# EAGLE board zx_kit2 (EAGLE 6.5.0), part 1 of 2
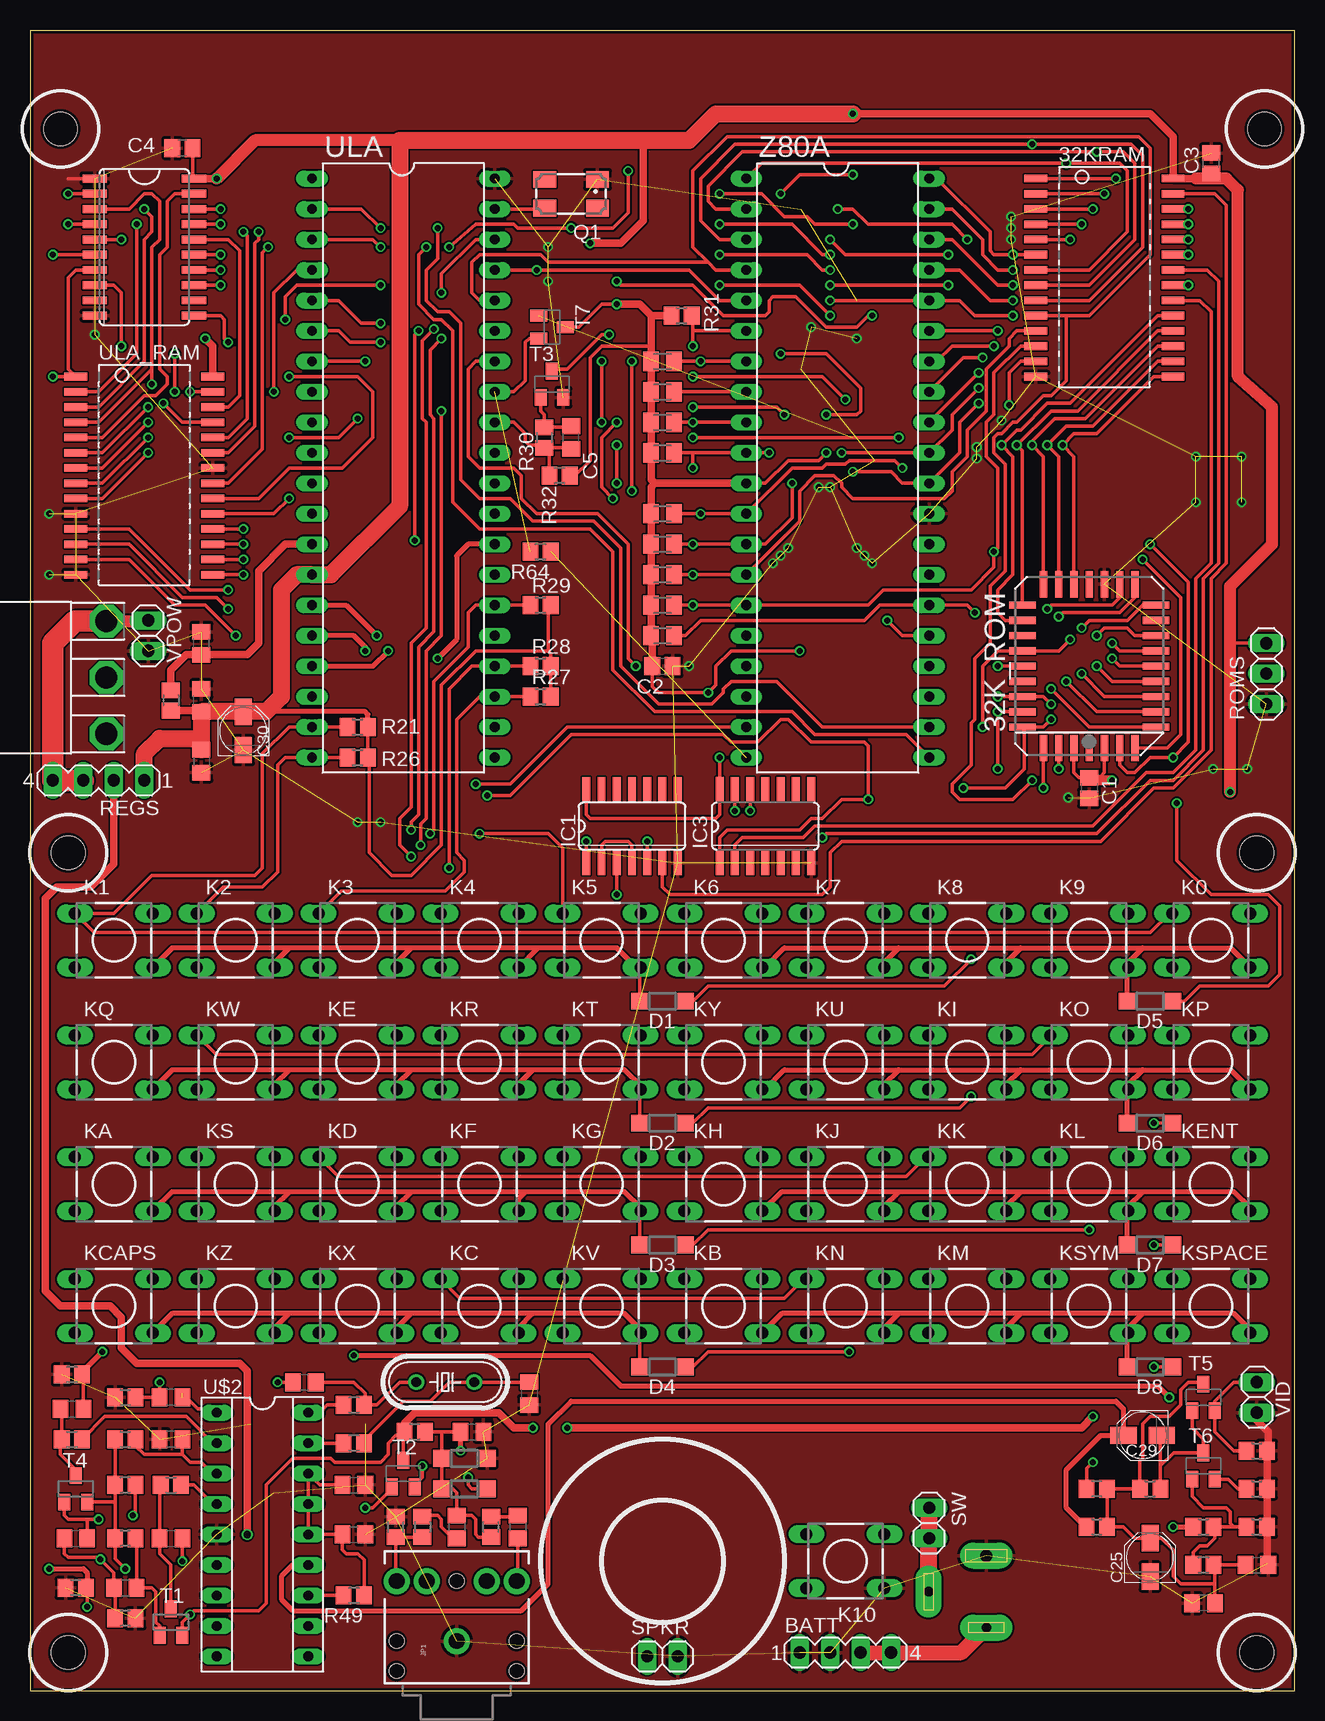
[diagram p3: board, top side]
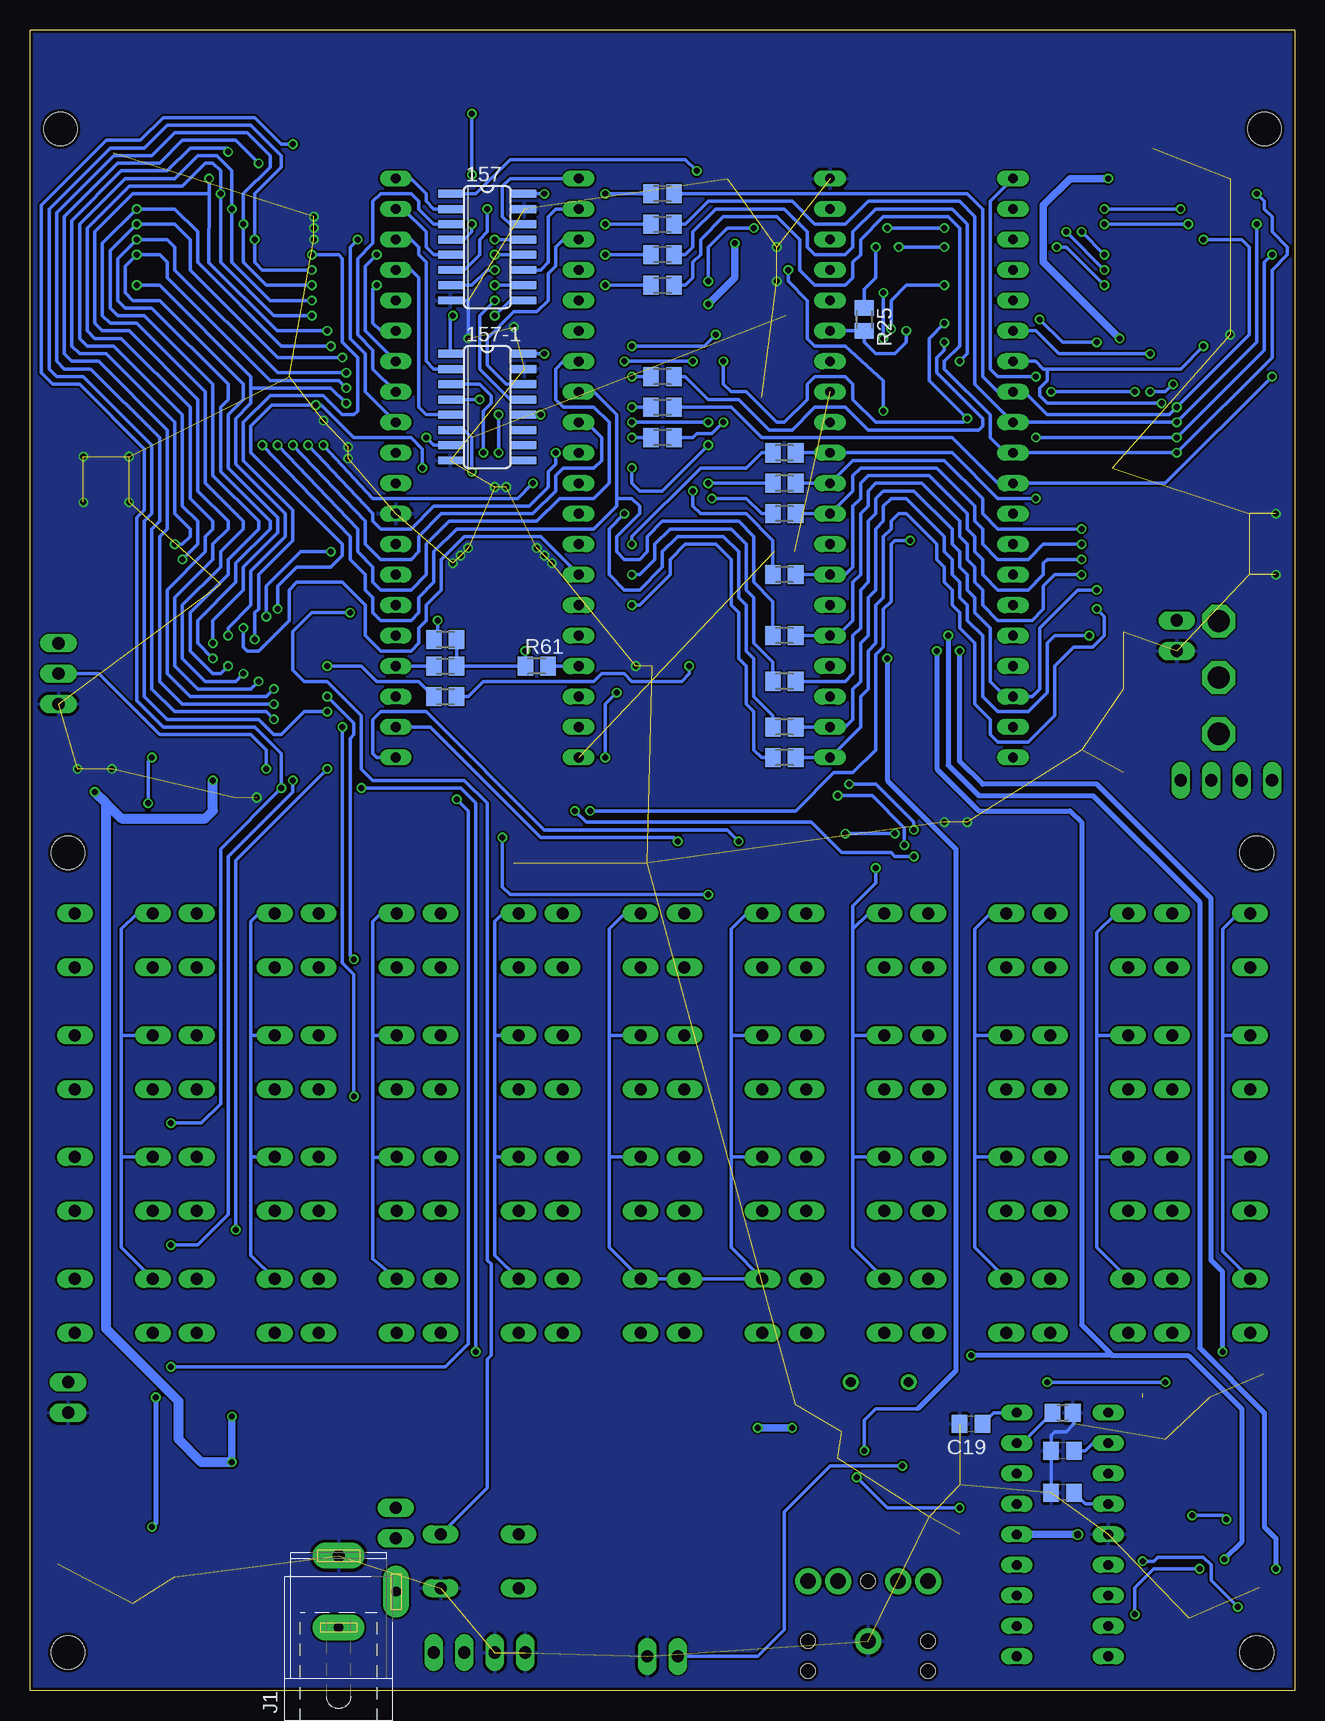
[diagram p4: board, bottom side, seen from below]

Size 105.41 x 138.43 mm. Coordinates in mm from the lower left corner, seen from the top.
Outline: 0,0 105.41,0 105.41,138.43 0,138.43 0,0
Copper layers (1*16): Top 0.035mm / dielectric 1.5mm / Bottom 0.035mm
Design rules "SeeedStudio_2layer_DRU_no_angle_20140221": minimum track width 6mil, minimum drill 12mil, track to track 6mil, track to pad 6mil, pad to pad 6mil, via to via 6mil, smd to smd 0mil, copper to edge 10mil, drill to drill 10mil, minimum pad ring 10mil, minimum via ring 6mil, stop-mask expansion 2mil, vias tented up to drill 100mil, thermal gap 10mil
Holes 2.8 mm at 102.23,3.17 3.17,3.17 102.87,130.18 2.54,130.18 102.23,69.85 3.17,69.85

## Footprints (pad centres in the part's own frame; a part is rotated, then mirrored left to right if it is on the bottom)
PLCC-32 = smd 2.2 x 0.6: 1 -6.83,0; 2 -6.83,-1.27; 3 -6.83,-2.54; 4 -6.83,-3.81; 14 6.83,-3.81; 15 6.83,-2.54; 16 6.83,-1.27; 17 6.83,0; 18 6.83,1.27; 19 6.83,2.54; 20 6.83,3.81; 30 -6.83,3.81; 31 -6.83,2.54; 32 -6.83,1.27 | smd 0.6 x 2.2: 5 -5.08,-5.56; 6 -3.81,-5.56; 7 -2.54,-5.56; 8 -1.27,-5.56; 9 0,-5.56; 10 1.27,-5.56; 11 2.54,-5.56; 12 3.81,-5.56; 13 5.08,-5.56; 21 5.08,5.56; 22 3.81,5.56; 23 2.54,5.56; 24 1.27,5.56; 25 0,5.56; 26 -1.27,5.56; 27 -2.54,5.56; 28 -3.81,5.56; 29 -5.08,5.56
SOJ28/3 = smd 0.635 x 1.905: 1 -8.255,-5.715; 2 -6.985,-5.715; 3 -5.715,-5.715; 4 -4.445,-5.715; 5 -3.175,-5.715; 6 -1.905,-5.715; 7 -0.635,-5.715; 8 0.635,-5.715; 9 1.905,-5.715; 10 3.175,-5.715; 11 4.445,-5.715; 12 5.715,-5.715; 13 6.985,-5.715; 14 8.255,-5.715; 15 8.255,5.715; 16 6.985,5.715; 17 5.715,5.715; 18 4.445,5.715; 19 3.175,5.715; 20 1.905,5.715; 21 0.635,5.715; 22 -0.635,5.715; 23 -1.905,5.715; 24 -3.175,5.715; 25 -4.445,5.715; 26 -5.715,5.715; 27 -6.985,5.715; 28 -8.255,5.715
SO16 = smd 0.66 x 2.032: 1 -4.445,-3.073; 2 -3.175,-3.073; 3 -1.905,-3.073; 4 -0.635,-3.073; 5 0.635,-3.073; 6 1.905,-3.073; 7 3.175,-3.073; 8 4.445,-3.073; 9 4.445,3.073; 10 3.175,3.073; 11 1.905,3.073; 12 0.635,3.073; 13 -0.635,3.073; 14 -1.905,3.073; 15 -3.175,3.073; 16 -4.445,3.073
MA04-1 = drill 1.016 long: 1 -3.81,0; 2 -1.27,0; 3 1.27,0; 4 3.81,0
C0805 = smd 1.3 x 1.5: 1 -0.85,0; 2 0.85,0
C0805' = smd 1.3 x 1.5: 1 -0.95,0; 2 0.95,0
PANASONIC_B = smd 2.2 x 1.4: + 1.6,0; - -1.6,0
SOD123 = smd 1.4 x 1.4: A 1.9,0; C -1.9,0
SO14 = smd 0.66 x 2.032: 1 -3.81,-3.073; 2 -2.54,-3.073; 3 -1.27,-3.073; 4 0,-3.073; 5 1.27,-3.073; 6 2.54,-3.073; 7 3.81,-3.073; 8 3.81,3.073; 9 2.54,3.073; 10 1.27,3.073; 11 0,3.073; 12 -1.27,3.073; 13 -2.54,3.073; 14 -3.81,3.073
SPC4077 = drill 0.8 pad 2.184 long: 1 -3,0; 2 0,-4.8 | drill 1 pad 2.184 long: 3 3,0
AUDIO-JACK = drill 1.3 pad 2.184: RING 5,5; RSH 5,2.5; SLEEVE 0,0; TIP 5,-5; TSH 5,-2.5 | hole 1.2: 0,5; -2.5,5; -2.5,-5; 0,-5; 5,0
DTS-6 = drill 1 long: 1 -3.25,2.25; 2 3.25,2.25; 3 -3.25,-2.25; 4 3.25,-2.25
CTS406 = smd 1.9 x 1.4: 1 -2.2,-1.2; 2 2.2,-1.2; 3 2.2,1.2; 4 -2.2,1.2
HC49/S = drill 0.813: 1 -2.413,0; 2 2.413,0
M0805 = smd 1.3 x 1.6: 1 -0.95,0; 2 0.95,0
R0805 = smd 1.3 x 1.5: 1 -0.85,0; 2 0.85,0
1X03 = drill 1.016 long: 1 -2.54,0; 2 0,0; 3 2.54,0
1X02 = drill 1.016 long: 1 -1.27,0; 2 1.27,0
SOT23 = smd 1 x 1.4: 1 -0.95,-1.1; 2 0.95,-1.1; 3 0,1.1
SOT23-BEC = smd 1 x 1.4: B -0.95,-1.1; C 0,1.1; E 0.95,-1.1
SO20W = smd 0.66 x 2.032: 1 -5.715,-4.128; 2 -4.445,-4.128; 3 -3.175,-4.128; 4 -1.905,-4.128; 5 -0.635,-4.128; 6 0.635,-4.128; 7 1.905,-4.128; 8 3.175,-4.128; 9 4.445,-4.128; 10 5.715,-4.128; 11 5.715,4.128; 12 4.445,4.128; 13 3.175,4.128; 14 1.905,4.128; 15 0.635,4.128; 16 -0.635,4.128; 17 -1.905,4.128; 18 -3.175,4.128; 19 -4.445,4.128; 20 -5.715,4.128
SOCKET-18 = drill 0.813 long: 1 -10.16,-3.81; 2 -7.62,-3.81; 3 -5.08,-3.81; 4 -2.54,-3.81; 5 0,-3.81; 6 2.54,-3.81; 7 5.08,-3.81; 8 7.62,-3.81; 9 10.16,-3.81; 10 10.16,3.81; 11 7.62,3.81; 12 5.08,3.81; 13 2.54,3.81; 14 0,3.81; 15 -2.54,3.81; 16 -5.08,3.81; 17 -7.62,3.81; 18 -10.16,3.81
MS12ASG30_01 = drill 1.854 octagon: 1 4.699,0; 2 0,0; 3 -4.699,0
DIL40 = drill 0.813 long: 1 -24.13,-7.62; 2 -21.59,-7.62; 3 -19.05,-7.62; 4 -16.51,-7.62; 5 -13.97,-7.62; 6 -11.43,-7.62; 7 -8.89,-7.62; 8 -6.35,-7.62; 9 -3.81,-7.62; 10 -1.27,-7.62; 11 1.27,-7.62; 12 3.81,-7.62; 13 6.35,-7.62; 14 8.89,-7.62; 15 11.43,-7.62; 16 13.97,-7.62; 17 16.51,-7.62; 18 19.05,-7.62; 19 21.59,-7.62; 20 24.13,-7.62; 21 24.13,7.62; 22 21.59,7.62; 23 19.05,7.62; 24 16.51,7.62; 25 13.97,7.62; 26 11.43,7.62; 27 8.89,7.62; 28 6.35,7.62; 29 3.81,7.62; 30 1.27,7.62; 31 -1.27,7.62; 32 -3.81,7.62; 33 -6.35,7.62; 34 -8.89,7.62; 35 -11.43,7.62; 36 -13.97,7.62; 37 -16.51,7.62; 38 -19.05,7.62; 39 -21.59,7.62; 40 -24.13,7.62

## Placement (x,y rotation side)
32K_ROM  27C256L  [PLCC-32]  88.27,85.41 90 top
32KRAM  CY62256LL-SNXI  [SOJ28/3]  89.53,117.79 270 top
157  SN74HC157D  [SO16]  67.31,120.33 270 bottom
157-1  SN74HC157D  [SO16]  67.31,107 270 bottom
BATT  [MA04-1]  67.94,3.17 0 top
C1  .1  [C0805]  88.27,75.25 270 top
C2  .1  [C0805]  52.7,85.41 0 top
C3  .1  [C0805]  98.42,127.32 90 top
C4  .1  [C0805]  12.7,128.59 180 top
C5  100pf  [C0805']  45.09,104.46 90 top
C6  .1uf  [C0805']  14.29,82.55 90 top
C7  22nf  [C0805']  14.29,87.31 90 top
C8  22nf  [C0805']  14.29,77.47 270 top
C9  .1uf  [C0805']  40.64,13.65 270 top
C10  .1uf  [C0805']  35.56,13.65 270 top
C11  10nf  [C0805']  36.83,21.59 0 top
C12  .1uf  [C0805']  3.81,12.7 0 top
C13  .1uf  [C0805']  7.94,8.57 0 top
C14  22nf  [C0805']  11.75,20.95 180 top
C15  .1uf  [C0805']  3.49,23.5 0 top
C16  .1uf  [C0805']  11.75,12.7 0 top
C17  10nf  [C0805']  11.75,24.45 180 top
C18  33pf  [C0805']  22.86,25.72 0 top
C19  33pf  [C0805']  26.99,22.23 180 bottom
C20  16pf  [C0805']  41.59,24.77 270 top
C21  150pf  [C0805']  19.37,20 180 bottom
C22  150pf  [C0805']  19.37,16.51 180 bottom
C23  22nf  [C0805']  26.99,17.14 0 top
C24  47nf  [C0805']  26.99,13.02 0 top
C25  22uf  [PANASONIC_B]  93.34,11.11 90 top
C26  22nf  [C0805']  97.79,7.3 180 top
C27  22nf  [C0805']  102.23,10.48 0 top
C29  22uf  [PANASONIC_B]  92.71,21.27 180 top
C30  22uf  [PANASONIC_B]  17.78,80.01 90 top
D1  [SOD123]  52.7,57.47 180 top
D2  [SOD123]  52.7,47.31 180 top
D3  [SOD123]  52.7,37.15 180 top
D4  [SOD123]  52.7,26.99 180 top
D5  [SOD123]  93.34,57.47 180 top
D6  [SOD123]  93.34,47.31 180 top
D7  [SOD123]  93.34,37.15 180 top
D8  [SOD123]  93.34,26.99 180 top
D9  [SOD123]  36.2,19.37 0 top
D10  [SOD123]  36.2,16.83 180 top
IC1  74LS32D  [SO14]  50.16,72.07 0 top
IC3  74AC04D  [SO14]  61.28,72.07 0 top
J1  [SPC4077]  79.69,8.26 90 bottom
JP1  [AUDIO-JACK]  35.56,4.13 90 top
K0  DTS-6  [DTS-6]  98.42,62.55 0 top
K1  DTS-6  [DTS-6]  6.99,62.55 0 top
K2  DTS-6  [DTS-6]  17.14,62.55 0 top
K3  DTS-6  [DTS-6]  27.3,62.55 0 top
K4  DTS-6  [DTS-6]  37.47,62.55 0 top
K5  DTS-6  [DTS-6]  47.62,62.55 0 top
K6  DTS-6  [DTS-6]  57.78,62.55 0 top
K7  DTS-6  [DTS-6]  67.94,62.55 0 top
K8  DTS-6  [DTS-6]  78.11,62.55 0 top
K9  DTS-6  [DTS-6]  88.27,62.55 0 top
K10  DTS-6  [DTS-6]  67.94,10.79 180 top
KA  DTS-6  [DTS-6]  6.99,42.23 0 top
KB  DTS-6  [DTS-6]  57.78,32.07 0 top
KC  DTS-6  [DTS-6]  37.47,32.07 0 top
KCAPS  DTS-6  [DTS-6]  6.99,32.07 0 top
KD  DTS-6  [DTS-6]  27.3,42.23 0 top
KE  DTS-6  [DTS-6]  27.3,52.39 0 top
KENT  DTS-6  [DTS-6]  98.42,42.23 0 top
KF  DTS-6  [DTS-6]  37.47,42.23 0 top
KG  DTS-6  [DTS-6]  47.62,42.23 0 top
KH  DTS-6  [DTS-6]  57.78,42.23 0 top
KI  DTS-6  [DTS-6]  78.11,52.39 0 top
KJ  DTS-6  [DTS-6]  67.94,42.23 0 top
KK  DTS-6  [DTS-6]  78.11,42.23 0 top
KL  DTS-6  [DTS-6]  88.27,42.23 0 top
KM  DTS-6  [DTS-6]  78.11,32.07 0 top
KN  DTS-6  [DTS-6]  67.94,32.07 0 top
KO  DTS-6  [DTS-6]  88.27,52.39 0 top
KP  DTS-6  [DTS-6]  98.42,52.39 0 top
KQ  DTS-6  [DTS-6]  6.99,52.39 0 top
KR  DTS-6  [DTS-6]  37.47,52.39 0 top
KS  DTS-6  [DTS-6]  17.14,42.23 0 top
KSPACE  DTS-6  [DTS-6]  98.42,32.07 0 top
KSYM  DTS-6  [DTS-6]  88.27,32.07 0 top
KT  DTS-6  [DTS-6]  47.62,52.39 0 top
KU  DTS-6  [DTS-6]  67.94,52.39 0 top
KV  DTS-6  [DTS-6]  47.62,32.07 0 top
KW  DTS-6  [DTS-6]  17.14,52.39 0 top
KX  DTS-6  [DTS-6]  27.3,32.07 0 top
KY  DTS-6  [DTS-6]  57.78,52.39 0 top
KZ  DTS-6  [DTS-6]  17.14,32.07 0 top
Q1  14MHz  [CTS406]  45.09,124.78 180 top
Q2  4.43MHz  [HC49/S]  34.61,25.72 180 top
R1  470  [M0805]  42.55,87.95 0 bottom
R2  470  [M0805]  42.55,93.03 0 bottom
R3  470  [M0805]  42.55,98.11 0 bottom
R4  470  [M0805]  42.55,84.14 0 bottom
R5  470  [M0805]  42.55,77.79 0 bottom
R6  470  [M0805]  42.55,80.33 0 bottom
R7  470  [M0805]  42.55,100.65 0 bottom
R8  470  [M0805]  42.55,103.19 0 bottom
R9  8K2  [M0805]  52.7,90.49 180 top
R10  8K2  [M0805]  52.7,98.11 180 top
R11  8K2  [M0805]  52.7,93.03 180 top
R12  8K2  [M0805]  52.7,108.27 180 top
R13  8K2  [M0805]  52.7,110.81 180 top
R14  8K2  [M0805]  52.7,105.73 180 top
R15  8K2  [M0805]  52.7,103.19 180 top
R16  8K2  [M0805]  52.7,95.57 180 top
R17  330  [M0805]  52.7,124.78 0 bottom
R18  330  [M0805]  52.7,119.7 0 bottom
R19  330  [M0805]  52.7,109.54 0 bottom
R20  330  [M0805]  52.7,104.46 0 bottom
R21  10k  [R0805]  27.3,80.33 0 top
R22  330  [M0805]  52.7,107 180 bottom
R23  330  [M0805]  52.7,117.16 180 bottom
R24  330  [M0805]  52.7,122.24 180 bottom
R25  330  [M0805]  35.88,114.3 270 bottom
R26  10k  [R0805]  27.3,77.79 0 top
R27  10k  [R0805]  42.55,82.87 0 top
R28  10k  [R0805]  42.55,85.41 0 top
R29  10k  [R0805]  42.55,90.49 0 top
R30  1k  [R0805]  42.86,104.46 270 top
R31  180  [R0805]  54.29,114.62 0 top
R32  1k  [R0805]  44.13,101.28 180 top
R33  15  [R0805]  11.75,82.55 270 top
R34  2k7  [R0805]  32.07,21.59 0 top
R35  10k  [R0805]  38.42,13.65 90 top
R36  680  [R0805]  32.7,13.65 270 top
R37  1k  [R0805]  30.48,13.65 90 top
R38  10k  [R0805]  7.94,17.14 180 top
R39  10k  [R0805]  7.94,12.7 180 top
R40  470  [R0805]  7.94,20.95 0 top
R41  1k  [R0805]  3.49,26.35 180 top
R42  1k  [R0805]  3.81,8.57 180 top
R43  1k  [R0805]  7.94,24.45 0 top
R44  1k  [R0805]  26.99,23.81 180 top
R45  5k1  [R0805]  26.99,20.64 180 top
R46  3k  [R0805]  19.37,23.18 0 bottom
R47  1k  [R0805]  11.75,17.14 0 top
R48  1k  [R0805]  3.49,20.95 0 top
R49  1k  [R0805]  26.99,7.94 180 top
R50  1k  [R0805]  7.94,6.03 180 top
R51  10K  [R0805]  88.9,13.65 0 top
R52  15  [R0805]  88.9,16.83 180 top
R53  2k2  [R0805]  93.34,16.83 0 top
R54  2k2  [R0805]  102.23,16.83 0 top
R55  390  [R0805]  102.23,20 0 top
R56  4k7  [R0805]  102.23,13.65 0 top
R57  2k2  [R0805]  97.79,13.65 0 top
R58  10k  [R0805]  97.79,10.48 180 top
R59  220k  [M0805]  52.7,87.95 180 top
R60  1k5  [M0805]  70.8,85.41 180 bottom
R61  10k  [M0805]  63.18,85.41 0 bottom
R62  1k  [M0805]  70.8,87.63 180 bottom
R63  600  [M0805]  70.8,82.87 180 bottom
R64  470  [R0805]  42.55,94.93 180 top
REGS  [MA04-1]  5.71,75.88 180 top
ROMS  [1X03]  103.03,84.77 90 top
SPKR  [1X02]  52.7,2.86 0 top
SW  [1X02]  74.93,13.97 270 top
T1  BC847  [SOT23]  11.75,5.71 0 top
T2  4401  [SOT23-BEC]  31.11,18.1 0 top
T3  4401  [SOT23-BEC]  43.5,108.9 0 top
T4  BC847  [SOT23]  3.81,16.83 0 top
T5  4401  [SOT23-BEC]  97.79,24.45 0 top
T6  4401  [SOT23-BEC]  97.79,18.73 0 top
T7  4401  [SOT23-BEC]  43.5,113.67 270 top
U$1  MC74HC574A  [SO20W]  9.53,120.33 270 top
U$2  LM1889  [SOCKET-18]  19.37,13.02 270 top
U$3  MS12ASW30_01  [MS12ASG30_01]  6.35,84.45 270 top
ULA  [DIL40]  31.11,101.92 270 top
ULA_RAM  CY62256LL-SNXI  [SOJ28/3]  9.53,101.28 270 top
VID  [1X02]  102.23,24.45 270 top
VPOW  [1X02]  9.84,87.95 90 top
Z80A  [DIL40]  67.31,101.92 270 top